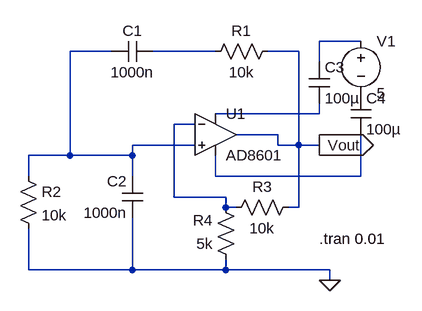
[diagram p0: schematic Draft18.asc]
Draft18.asc, the LTspice schematic file:
Version 4
SHEET 1 1000 880
WIRE 592 176 528 176
WIRE 208 192 144 192
WIRE 368 192 272 192
WIRE 496 192 448 192
WIRE 528 208 528 176
WIRE 528 288 528 272
WIRE 528 288 368 288
WIRE 336 304 304 304
WIRE 464 320 400 320
WIRE 336 336 240 336
WIRE 464 336 464 320
WIRE 496 336 496 192
WIRE 496 336 464 336
WIRE 528 336 496 336
WIRE 144 352 144 192
WIRE 144 352 80 352
WIRE 240 352 240 336
WIRE 240 352 144 352
WIRE 80 384 80 352
WIRE 240 384 240 352
WIRE 368 384 368 352
WIRE 592 384 592 320
WIRE 592 384 368 384
WIRE 304 416 304 304
WIRE 384 416 304 416
WIRE 384 432 384 416
WIRE 400 432 384 432
WIRE 496 432 496 336
WIRE 496 432 480 432
WIRE 80 528 80 464
WIRE 240 528 240 448
WIRE 240 528 80 528
WIRE 384 528 384 512
WIRE 384 528 240 528
WIRE 544 528 384 528
WIRE 544 544 544 528
FLAG 544 544 0
FLAG 528 336 Vout
IOPIN 528 336 Out
SYMBOL res 464 176 R90
WINDOW 0 0 56 VBottom 2
WINDOW 3 32 56 VTop 2
SYMATTR InstName R1
SYMATTR Value 10k
SYMBOL cap 272 176 R90
WINDOW 0 0 32 VBottom 2
WINDOW 3 32 32 VTop 2
SYMATTR InstName C1
SYMATTR Value 1000n
SYMBOL cap 256 448 R180
WINDOW 0 24 56 Left 2
WINDOW 3 24 8 Left 2
SYMATTR InstName C2
SYMATTR Value 1000n
SYMBOL res 64 368 R0
SYMATTR InstName R2
SYMATTR Value 10k
SYMBOL res 496 416 R90
WINDOW 0 0 56 VBottom 2
WINDOW 3 32 56 VTop 2
SYMATTR InstName R3
SYMATTR Value 10k
SYMBOL res 400 528 R180
WINDOW 0 36 76 Left 2
WINDOW 3 36 40 Left 2
SYMATTR InstName R4
SYMATTR Value 5k
SYMBOL Opamps/AD8601 368 256 R0
SYMATTR InstName U1
SYMBOL voltage 592 160 R0
SYMATTR InstName V1
SYMATTR Value 5
SYMBOL cap 512 208 R0
SYMATTR InstName C3
SYMATTR Value 100µ
SYMBOL cap 576 256 R0
SYMATTR InstName C4
SYMATTR Value 100µ
TEXT 528 480 Left 2 !.tran 0.01

The netlist it stands for:
* Draft18.asc
R1 Vout N003 10k
C1 N003 N002 1000n
C2 0 N002 1000n
R2 N002 0 10k
R3 Vout N005 10k
R4 0 N005 5k
XU1 N002 N005 N004 N006 Vout AD8601  ; pins In+ In- V+ V- OUT
V1 N001 P001 5
C3 N001 N004 100µ
C4 P001 N006 100µ
.tran 0.01
.backanno
.end